# Altium schematic sheet test-board-molex-bias-tee.SchDoc
size A; SheetNumber: 1; SheetTotal: 1
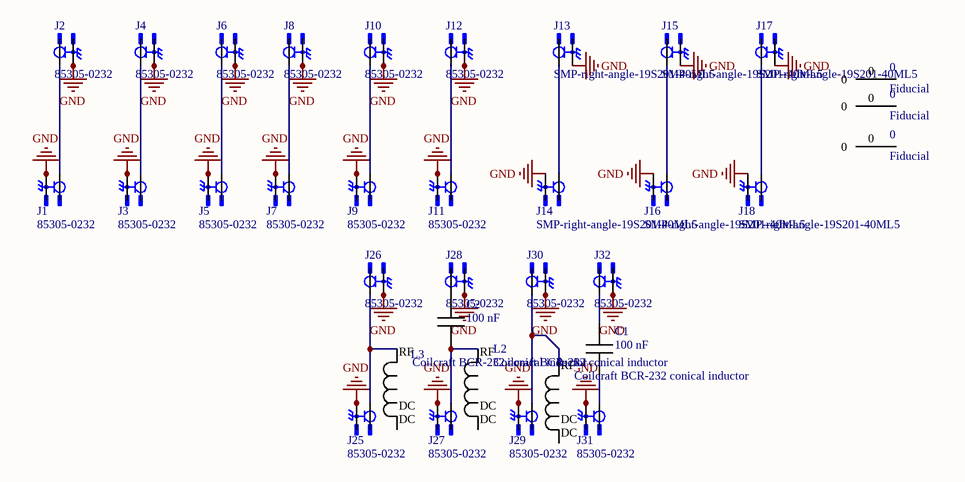
[diagram p0: test-board-molex-bias-tee.SchDoc]

## Parts
(Parts that share a designator on the sheet are numbered #1, #2 ... from top to bottom, then left to right.)
0#1  Fiducial  [fiducial]
0#2  Fiducial  [fiducial]
0#3  Fiducial  [fiducial]
C1  100 nF  [0201-capacitor]
C2  100 nF  [0201-capacitor]
J1  85305-0232  [MOLEX_85305-0232]
J2  85305-0232  [MOLEX_85305-0232]
J3  85305-0232  [MOLEX_85305-0232]
J4  85305-0232  [MOLEX_85305-0232]
J5  85305-0232  [MOLEX_85305-0232]
J6  85305-0232  [MOLEX_85305-0232]
J7  85305-0232  [MOLEX_85305-0232]
J8  85305-0232  [MOLEX_85305-0232]
J9  85305-0232  [MOLEX_85305-0232]
J10  85305-0232  [MOLEX_85305-0232]
J11  85305-0232  [MOLEX_85305-0232]
J12  85305-0232  [MOLEX_85305-0232]
J13  SMP-right-angle-19S201-40ML5  [rosenberger-19S201-40ML5]
J14  SMP-right-angle-19S201-40ML5  [rosenberger-19S201-40ML5]
J15  SMP-right-angle-19S201-40ML5  [rosenberger-19S201-40ML5]
J16  SMP-right-angle-19S201-40ML5  [rosenberger-19S201-40ML5]
J17  SMP-right-angle-19S201-40ML5  [rosenberger-19S201-40ML5]
J18  SMP-right-angle-19S201-40ML5  [rosenberger-19S201-40ML5]
J25  85305-0232  [MOLEX_85305-0232]
J26  85305-0232  [MOLEX_85305-0232]
J27  85305-0232  [MOLEX_85305-0232]
J28  85305-0232  [MOLEX_85305-0232]
J29  85305-0232  [MOLEX_85305-0232]
J30  85305-0232  [MOLEX_85305-0232]
J31  85305-0232  [MOLEX_85305-0232]
J32  85305-0232  [MOLEX_85305-0232]
L1  Coilcraft BCR-232 conical inductor  [Coilcraft BCR-232 conical inductor]
L2  Coilcraft BCR-232 conical inductor  [Coilcraft BCR-232 conical inductor]
L3  Coilcraft BCR-232 conical inductor  [Coilcraft BCR-232 conical inductor]

## Nets
GND: J1.2 J1.3 J1.4 J1.5 J1.6 J1.7 J1.8 J1.9 J1.10 J1.11 J1.12 J1.13 J1.14 J1.15 J1.16 J1.17 J1.18 J2.2 J2.3 J2.4 J2.5 J2.6 J2.7 J2.8 J2.9 J2.10 J2.11 J2.12 J2.13 J2.14 J2.15 J2.16 J2.17 J2.18 J3.2 J3.3 J3.4 J3.5 J3.6 J3.7 J3.8 J3.9 J3.10 J3.11 J3.12 J3.13 J3.14 J3.15 J3.16 J3.17 J3.18 J4.2 J4.3 J4.4 J4.5 J4.6 J4.7 J4.8 J4.9 J4.10 J4.11 J4.12 J4.13 J4.14 J4.15 J4.16 J4.17 J4.18 J5.2 J5.3 J5.4 J5.5 J5.6 J5.7 J5.8 J5.9 J5.10 J5.11 J5.12 J5.13 J5.14 J5.15 J5.16 J5.17 J5.18 J6.2 J6.3 J6.4 J6.5 J6.6 J6.7 J6.8 J6.9 J6.10 J6.11 J6.12 J6.13 J6.14 J6.15 J6.16 J6.17 J6.18 J7.2 J7.3 J7.4 J7.5 J7.6 J7.7 J7.8 J7.9 J7.10 J7.11 J7.12 J7.13 J7.14 J7.15 J7.16 J7.17 J7.18 J8.2 J8.3 J8.4 J8.5 J8.6 J8.7 J8.8 J8.9 J8.10 J8.11 J8.12 J8.13 J8.14 J8.15 J8.16 J8.17 J8.18 J9.2 J9.3 J9.4 J9.5 J9.6 J9.7 J9.8 J9.9 J9.10 J9.11 J9.12 J9.13 J9.14 J9.15 J9.16 J9.17 J9.18 J10.2 J10.3 J10.4 J10.5 J10.6 J10.7 J10.8 J10.9 J10.10 J10.11 J10.12 J10.13 J10.14 J10.15 J10.16 J10.17 J10.18 J11.2 J11.3 J11.4 J11.5 J11.6 J11.7 J11.8 J11.9 J11.10 J11.11 J11.12 J11.13 J11.14 J11.15 J11.16 J11.17 J11.18 J12.2 J12.3 J12.4 J12.5 J12.6 J12.7 J12.8 J12.9 J12.10 J12.11 J12.12 J12.13 J12.14 J12.15 J12.16 J12.17 J12.18 J13.gnd J14.gnd J15.gnd J16.gnd J17.gnd J18.gnd J25.2 J25.3 J25.4 J25.5 J25.6 J25.7 J25.8 J25.9 J25.10 J25.11 J25.12 J25.13 J25.14 J25.15 J25.16 J25.17 J25.18 J26.2 J26.3 J26.4 J26.5 J26.6 J26.7 J26.8 J26.9 J26.10 J26.11 J26.12 J26.13 J26.14 J26.15 J26.16 J26.17 J26.18 J27.2 J27.3 J27.4 J27.5 J27.6 J27.7 J27.8 J27.9 J27.10 J27.11 J27.12 J27.13 J27.14 J27.15 J27.16 J27.17 J27.18 J28.2 J28.3 J28.4 J28.5 J28.6 J28.7 J28.8 J28.9 J28.10 J28.11 J28.12 J28.13 J28.14 J28.15 J28.16 J28.17 J28.18 J29.2 J29.3 J29.4 J29.5 J29.6 J29.7 J29.8 J29.9 J29.10 J29.11 J29.12 J29.13 J29.14 J29.15 J29.16 J29.17 J29.18 J30.2 J30.3 J30.4 J30.5 J30.6 J30.7 J30.8 J30.9 J30.10 J30.11 J30.12 J30.13 J30.14 J30.15 J30.16 J30.17 J30.18 J31.2 J31.3 J31.4 J31.5 J31.6 J31.7 J31.8 J31.9 J31.10 J31.11 J31.12 J31.13 J31.14 J31.15 J31.16 J31.17 J31.18 J32.2 J32.3 J32.4 J32.5 J32.6 J32.7 J32.8 J32.9 J32.10 J32.11 J32.12 J32.13 J32.14 J32.15 J32.16 J32.17 J32.18
NetC1_1: C1.1 J31.1
NetC1_2: C1.2 J32.1
NetC2_1: C2.1 J27.1 L2.1
NetC2_2: C2.2 J28.1
NetJ1_1: J1.1 J2.1
NetJ3_1: J3.1 J4.1
NetJ5_1: J5.1 J6.1
NetJ7_1: J7.1 J8.1
NetJ9_1: J9.1 J10.1
NetJ11_1: J11.1 J12.1
NetJ13_1: J13.1 J14.1
NetJ15_1: J15.1 J16.1
NetJ17_1: J17.1 J18.1
NetJ25_1: J25.1 J26.1 L3.1
NetJ29_1: J29.1 J30.1 L1.1

Not connected (* = marked no-connect by the designer): 0#1 0; 0#2 0; 0#3 0; L1 2; L2 2; L3 2

## Notes on the sheet
- (in symbol Coilcraft BCR-232 conical inductor) RF; DC / DC

## Library data of the parts
C1 C2 = 100 nF DC block capacitor 0201: BROADBAND CAPACITOR, 100 nF, 0201
J1-J12 J25-J32 = 85305-0232: SMP Connector Plug, Male Pin 50Ohm Surface Mount Solder; MP: 853050232; MF: Molex; Check_prices: https://www.snapeda.com/parts/853050232/Molex/view-part/?ref=eda; Value: *; Availability: In Stock; Price: None; Package: None; SnapEDA_Link: https://www.snapeda.com/parts/853050232/Molex/view-part/?ref=snap; Purchase-URL: https://pricing.snapeda.com/search/part/853050232/?ref=eda
J13-J18 = SMP-right-angle-19S201-40ML5: SMOOTH BORE SMP Connector Plug, Male Pin 50Ohm Surface Mount Solder; MP: 853050232; MF: Molex; Check_prices: https://www.snapeda.com/parts/853050232/Molex/view-part/?ref=eda; Value: *; Availability: In Stock; Price: None; Package: None; SnapEDA_Link: https://www.snapeda.com/parts/853050232/Molex/view-part/?ref=snap; Purchase-URL: https://pricing.snapeda.com/search/part/853050232/?ref=eda; Supplier 1: Mouser; Supplier Part Number 1: 476-19S201-40ML5
L1-L3 = Coilcraft BCR-232 conical inductor: No Description Available; Mfr_Name: Murata